# EAGLE schematic databank (EAGLE 6.4)
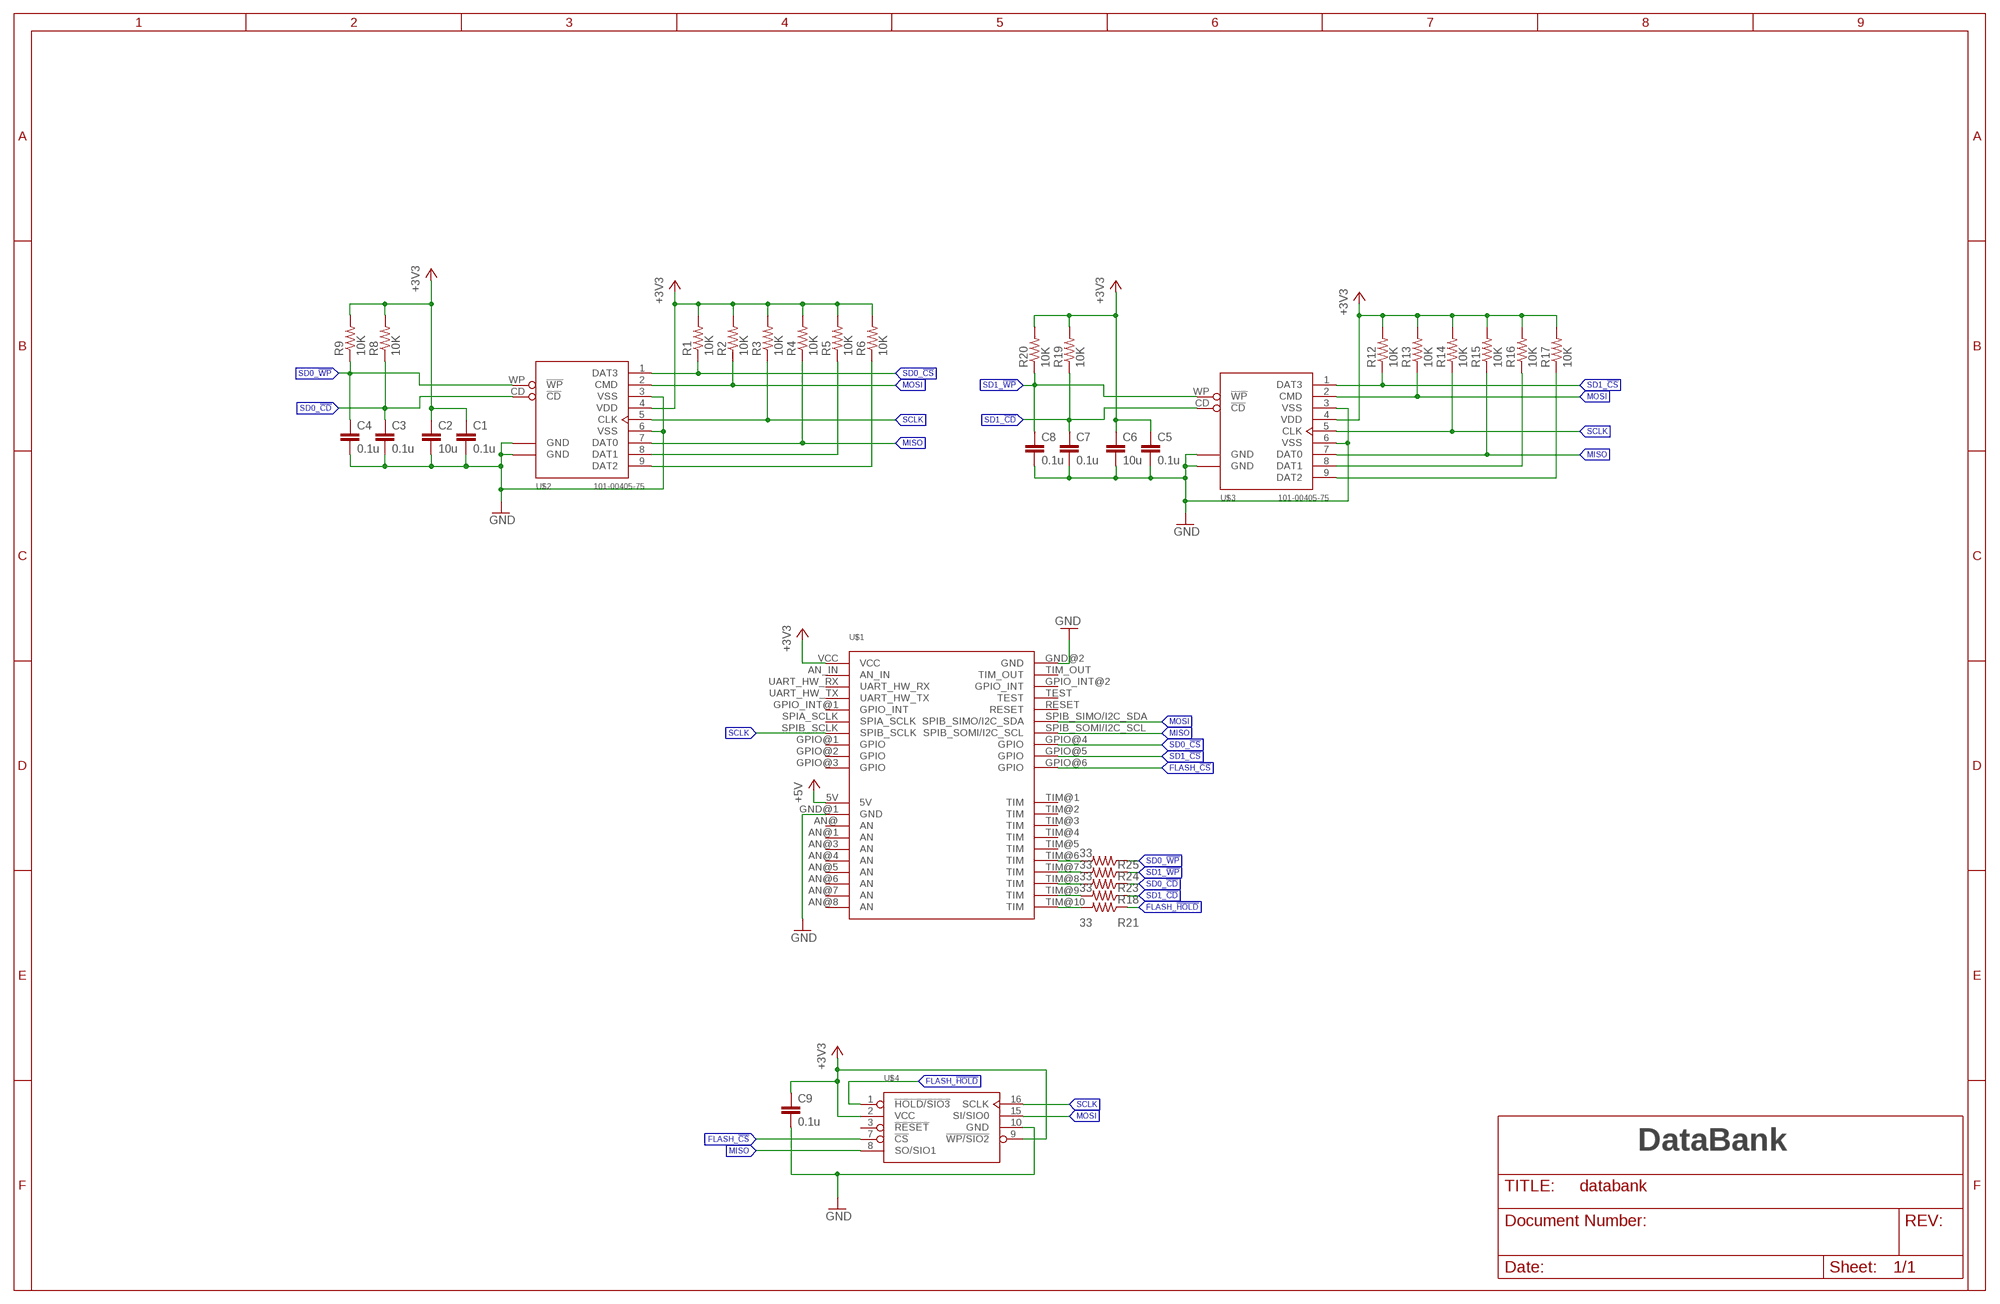
[diagram p0: schematic, sheet 1]

## Parts
C1  0.1u  C-EUC0603  [C0603]
C2  10u  C-EUC0603  [C0603]
C3  0.1u  C-EUC0603  [C0603]
C4  0.1u  C-EUC0603  [C0603]
C5  0.1u  C-EUC0603  [C0603]
C6  10u  C-EUC0603  [C0603]
C7  0.1u  C-EUC0603  [C0603]
C8  0.1u  C-EUC0603  [C0603]
C9  0.1u  C-EUC0603  [C0603]
R1  10K  R-US_R0603  [R0603]
R2  10K  R-US_R0603  [R0603]
R3  10K  R-US_R0603  [R0603]
R4  10K  R-US_R0603  [R0603]
R5  10K  R-US_R0603  [R0603]
R6  10K  R-US_R0603  [R0603]
R8  10K  R-US_R0603  [R0603]
R9  10K  R-US_R0603  [R0603]
R12  10K  R-US_R0603  [R0603]
R13  10K  R-US_R0603  [R0603]
R14  10K  R-US_R0603  [R0603]
R15  10K  R-US_R0603  [R0603]
R16  10K  R-US_R0603  [R0603]
R17  10K  R-US_R0603  [R0603]
R18  33  R-US_R0603  [R0603]
R19  10K  R-US_R0603  [R0603]
R20  10K  R-US_R0603  [R0603]
R21  33  R-US_R0603  [R0603]
R23  33  R-US_R0603  [R0603]
R24  33  R-US_R0603  [R0603]
R25  33  R-US_R0603  [R0603]
U$1  LAUNCHPAD_BOOSTER_PACK  [LAUNCHPAD_BOOSTER_PACK]
U$2  101-00405-75  [101-00405-75]
U$3  101-00405-75  [101-00405-75]
U$4  MX25L25635E  [SO-16LD]

## Nets
+3V3: C1.1 C2.1 C5.1 C6.1 C9.1 R1.2 R2.2 R3.2 R4.2 R5.2 R6.2 R8.2 R9.2 R12.2 R13.2 R14.2 R15.2 R16.2 R17.2 R19.2 R20.2 U$1.VCC U$2.4(VDD) U$3.4(VDD) U$4.2(VCC) U$4.9(!WP/SIO2)
+5V: U$1.5V
FLASH_!CS: U$1.GPIO@6(GPIO) U$4.7(!CS)
FLASH_!HOLD: R21.1 U$4.1(!HOLD/SIO3)
GND: C1.2 C2.2 C3.2 C4.2 C5.2 C6.2 C7.2 C8.2 C9.2 U$1.GND@1(GND) U$1.GND@2(GND) U$2.3(VSS) U$2.6(VSS) U$2.G1$GND(GND) U$2.G2$GND(GND) U$3.3(VSS) U$3.6(VSS) U$3.G1$GND(GND) U$3.G2$GND(GND) U$4.10(GND)
MISO: R4.1 R15.1 U$1.SPIB_SOMI/I2C_SCL U$2.7(DAT0) U$3.7(DAT0) U$4.8(SO/SIO1)
MOSI: R2.1 R13.1 U$1.SPIB_SIMO/I2C_SDA U$2.2(CMD) U$3.2(CMD) U$4.15(SI/SIO0)
N$2: R16.1 U$3.8(DAT1)
N$3: R17.1 U$3.9(DAT2)
N$5: R5.1 U$2.8(DAT1)
N$6: R6.1 U$2.9(DAT2)
N$8: R21.2 U$1.TIM@10(TIM)
N$9: R18.2 U$1.TIM@9(TIM)
N$11: R23.2 U$1.TIM@8(TIM)
N$12: R24.2 U$1.TIM@7(TIM)
N$13: R25.2 U$1.TIM@6(TIM)
SCLK: R3.1 R14.1 U$1.SPIB_SCLK U$2.5(CLK) U$3.5(CLK) U$4.16(SCLK)
SD0_!CD: C3.1 R8.1 R23.1 U$2.CD(!CD)
SD0_!CS: R1.1 U$1.GPIO@4(GPIO) U$2.1(DAT3)
SD0_!WP: C4.1 R9.1 R25.1 U$2.WP(!WP)
SD1_!CD: C7.1 R18.1 R19.1 U$3.CD(!CD)
SD1_!CS: R12.1 U$1.GPIO@5(GPIO) U$3.1(DAT3)
SD1_!WP: C8.1 R20.1 R24.1 U$3.WP(!WP)
Unconnected: U$1.AN@1(AN) U$1.AN@3(AN) U$1.AN@4(AN) U$1.AN@5(AN) U$1.AN@6(AN) U$1.AN@7(AN) U$1.AN@8(AN) U$1.AN@(AN) U$1.AN_IN U$1.GPIO@1(GPIO) U$1.GPIO@2(GPIO) U$1.GPIO@3(GPIO) U$1.GPIO_INT@1(GPIO_INT) U$1.GPIO_INT@2(GPIO_INT) U$1.RESET U$1.SPIA_SCLK U$1.TEST U$1.TIM@1(TIM) U$1.TIM@2(TIM) U$1.TIM@3(TIM) U$1.TIM@4(TIM) U$1.TIM@5(TIM) U$1.TIM_OUT U$1.UART_HW_RX U$1.UART_HW_TX U$4.3(!RESET)

## Notes on the sheet
- DataBank

## Library data of the parts
C1 C3-C5 C7-C9 = rcl:C-EU: CAPACITOR, European symbol; MPN: VJ0603V104ZXXCW1BC
C2 C6 = rcl:C-EU: CAPACITOR, European symbol; MPN: LMK107BBJ106MALT
R1-R6 R8 R9 R12-R17 R19 R20 = rcl:R-US_: RESISTOR, American symbol; MPN: WR06X1002FTL
R18 R21 R23-R25 = rcl:R-US_: RESISTOR, American symbol; MPN: CR0402-JW-330GLF
U$1 = Boards:LAUNCHPAD_BOOSTER_PACK
U$2 U$3 = launchpad_bp:101-00405-75; MPN: 101-00405-75
U$4 = launchpad_bp:MX25L25635E; MPN: MX25L25635E

## Net classes
0 default: width 0.152 mm, drill 0.381 mm, clearance 0.152 mm
1 pwr: width 0.305 mm, drill 0.381 mm, clearance 0.152 mm